# EAGLE design MaTouch Devkit_LED Screen V1.2 (EAGLE 6.1)
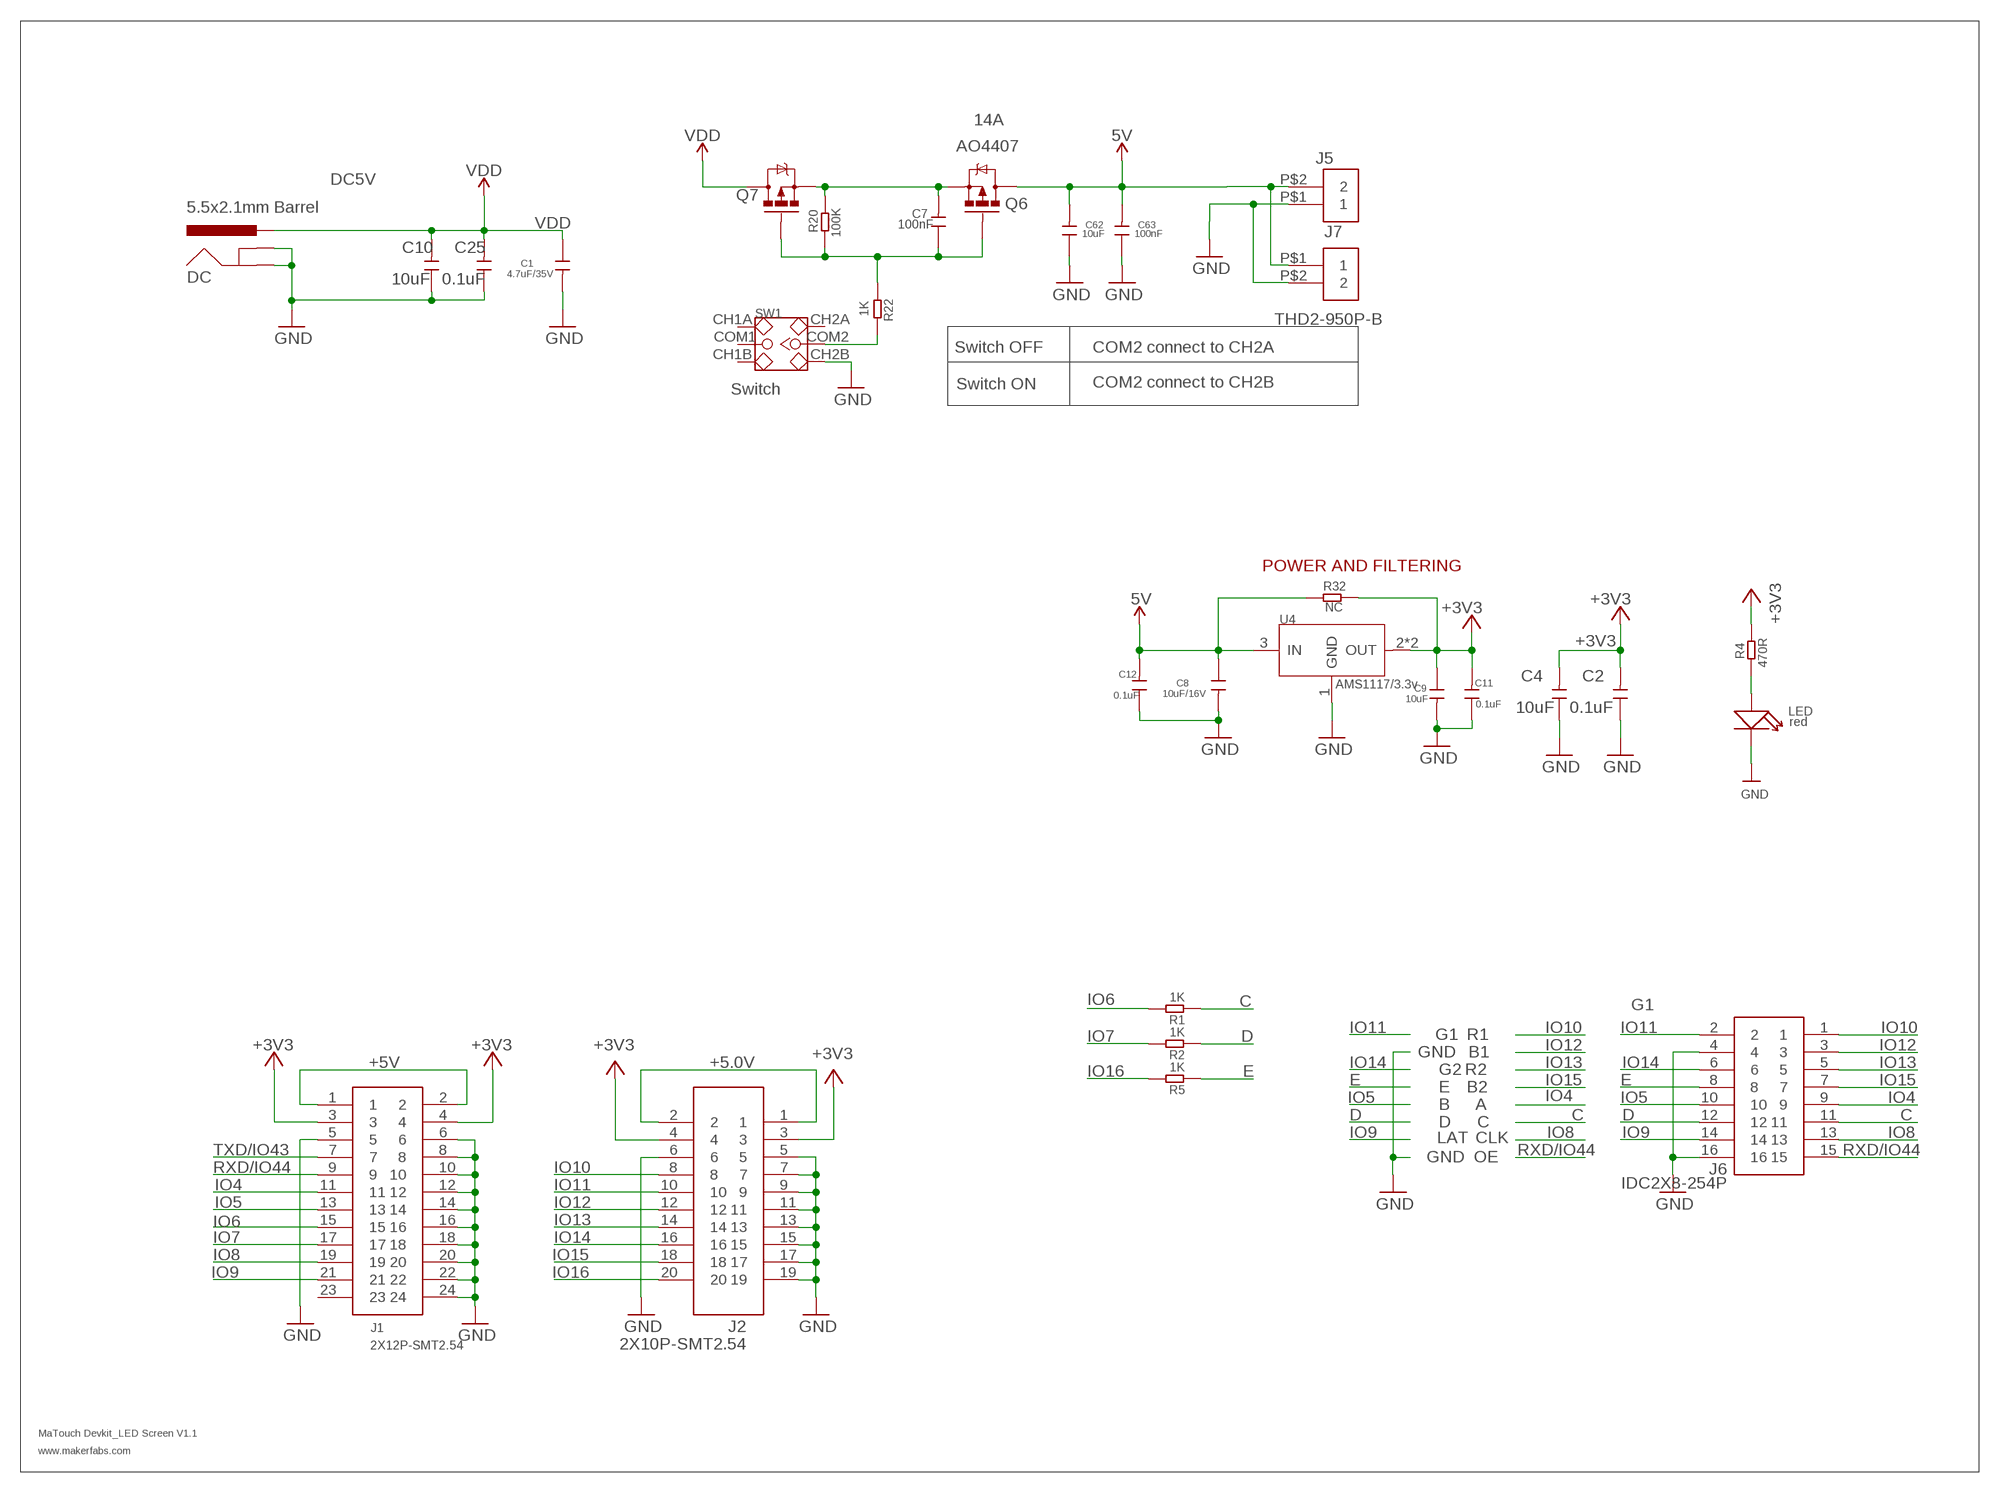
[diagram p0: schematic, sheet 1]

## Parts
C1  4.7uF/35V  C-0603  [0603]
C2  0.1uF  C-0603  [0603]
C4  10uF  C-0603  [0603]
C7  100nF  C-0603  [0603]
C8  10uF/16V  C-0603  [0603]
C9  10uF  C-0603  [0603]
C10  10uF  C-0603  [0603]
C11  0.1uF  C-0603  [0603]
C12  0.1uF  C-0603  [0603]
C25  0.1uF  C-0603  [0603]
C62  10uF  C-0603  [0603]
C63  100nF  C-0603  [0603]
DC  5.5x2.1mm Barrel  POWER_JACKSMD  [POWER_JACK_SMD]
J1  2X12P-SMT2.54  [2X12P-SMT2.54]
J2  2X10P-SMT2.54  [2X10P-SMT2.54]
J5  THD2-950P-2050L1620W1670H  [THD2-950P-2050L1620W1670H]
J6  IDC2X8-254P  IDC2X8-254P-2792L1330W890H  [IDC2X8-254P-2792L1330W890H]
J7  THD2-950P-B  [THD2-950P-2100L1580W1780H]
LED  red  DISCRETE_LED0603  [DISCRETE_LED-0603]
Q6  MOSFET-PCHANNELFDS6675  [SO08]
Q7  MOSFET-PCHANNELFDS6675  [SO08]
R1  1K  R-0603  [R0603]
R2  1K  R-0603  [R0603]
R4  470R  R-0603  [R0603]
R5  1K  R-0603  [R0603]
R20  100K  R-0603  [R0603]
R22  1K  R-0603  [R0603]
R32  NC  R-0603  [R0603]
SW1  SWITCH-2CH-6P'90D'  [6P-2CH-2.54-9.0X3.6-90D]
U4  AMS1117/3.3v  LD1117'SOT89'  [SOT89]

## Nets
5V: C8.1 C12.2 C62.2 C63.2 J5.P$2 J7.P$1 Q6.5(D) Q6.6(D) Q6.7(D) Q6.8(D) R32.1 U4.3(IN)
+3V3: C2.2 C4.2 C9.1 C11.2 J1.3 J1.4 J2.3 J2.4 R4.2 R32.2 U4.2(OUT) U4.4(OUT)
+5.0V: J2.1 J2.2
+5V: J1.1 J1.2
C: J6.11 R1.1
D: J6.12 R2.1
E: J6.8 R5.1
GND: C1.2 C2.1 C4.1 C8.2 C9.2 C10.1 C11.1 C12.1 C25.1 C62.1 C63.1 DC.GND(GNDBREAK) DC.P$4(GND) J1.5 J1.6 J1.8 J1.10 J1.12 J1.14 J1.16 J1.18 J1.20 J1.22 J1.24 J2.5 J2.6 J2.7 J2.9 J2.11 J2.13 J2.15 J2.17 J2.19 J5.P$1 J6.4 J6.16 J7.P$2 LED.- SW1.CH2B U4.1(GND)
IO4: J1.11 J6.9
IO5: J1.13 J6.10
IO6: J1.15 R1.2
IO7: J1.17 R2.2
IO8: J1.19 J6.13
IO9: J1.21 J6.14
IO10: J2.8 J6.1
IO11: J2.10 J6.2
IO12: J2.12 J6.3
IO13: J2.14 J6.5
IO14: J2.16 J6.6
IO15: J2.18 J6.7
IO16: J2.20 R5.2
N$2: LED.+ R4.1
N$9: C7.1 Q6.4(G) Q7.4(G) R20.2 R22.2
N$10: R22.1 SW1.COM2
N$49: C7.2 Q6.1(S) Q6.2(S) Q6.3(S) Q7.1(S) Q7.2(S) Q7.3(S) R20.1
RXD/IO44: J1.9 J6.15
TXD/IO43: J1.7
VDD: C1.1 C10.2 C25.2 DC.VIN0(PWR) Q7.5(D) Q7.6(D) Q7.7(D) Q7.8(D)
Unconnected: J1.23 SW1.CH1A SW1.CH1B SW1.CH2A SW1.COM1

## Notes on the sheet
- 14A
- AO4407
- DC5V
- Switch OFF | COM2 connect to CH2A
- Switch ON | COM2 connect to CH2B
- Switch
- POWER AND FILTERING
- G1
- G1 | R1
- GND | B1
- G2 | R2
- E | B2
- B | A
- D | C
- LAT | CLK
- GND | OE
- MaTouch Devkit_LED Screen V1.1
- www.makerfabs.com

## Library data of the parts
C1 C2 C4 C7-C12 C25 C62 C63 = Discrete:C*: Ceramic Capacitors
DC = SparkFun-Connectors:POWER_JACK: Power Jack Connector This is the standard 5.5mm barrel jack for power. The PTH is the most common, proven, reliable, footprint. The Slot footprint only works if the mill layer is transmitted to the PCB fab house so be warned. Here are the connectors we sell at SparkFun: DC Barrel Power Jack/Connector <https://www.sparkfun.com/products/119> (PRT-00119) DC Barrel Power Jack/Connector (SMD) <https://www.sparkfun.com/products/12748> (PRT-12748) DC Barrel Jack Adapter - Breadboard Compatible <https://www.sparkfun.com/products/10811> (PRT-10811) It is used on this SparkFun product (and many, many others): SparkFun RedBoard - Programmed with Arduino <https://www.sparkfun.com/products/12757> (DEV-12757) Also, if you need a mating power supply or connector, please check these out: Wall Adapter Power Supply - 9VDC 650mA <https://www.sparkfun.com/products/298> (TOL-00298) DC Barrel Jack Adapter - Male <https://www.sparkfun.com/products/10287> (PRT-10287); PROD_ID: CONN-08106; SF_ID: PRT-12748
J1 = sale:2X12P-SMT2.54
J2 = sale:2X10P-SMT2.54
J5 = user:THD2-950P-2050L1620W1670H
J6 = user:IDC2X8-254P-2792L1330W890H
J7 = user:THD2-950P-B
LED = A9G:DISCRETE_LED*
Q6 Q7 = User-Submitted:MOSFET-PCHANNEL: Generic PMOSFET IRLML2244 - TRANS-11153 (SOT-23 -20V -4.3A) (1.Gate 2.Source 3.Drain) FQP27P06 - COM-10349 <http://www.sparkfun.com/products/10349> (TO-220 -60V -27A) (1.Gate 2.Source 3.Drain)
R1 R2 R4 R5 R20 R22 R32 = Discrete:R*
SW1 = Discrete:SWITCH-2CH-6P
U4 = IC:LD1117: Low Drop Fixed And Adjustable Positive Voltage Regulators http://www.datasheetcatalog.org/datasheet/SGSThomsonMicroelectronics/mXuqtqv.pdf

## Net classes
0 default: width 0.203 mm, drill 0.305 mm, clearance 0.152 mm

## Board
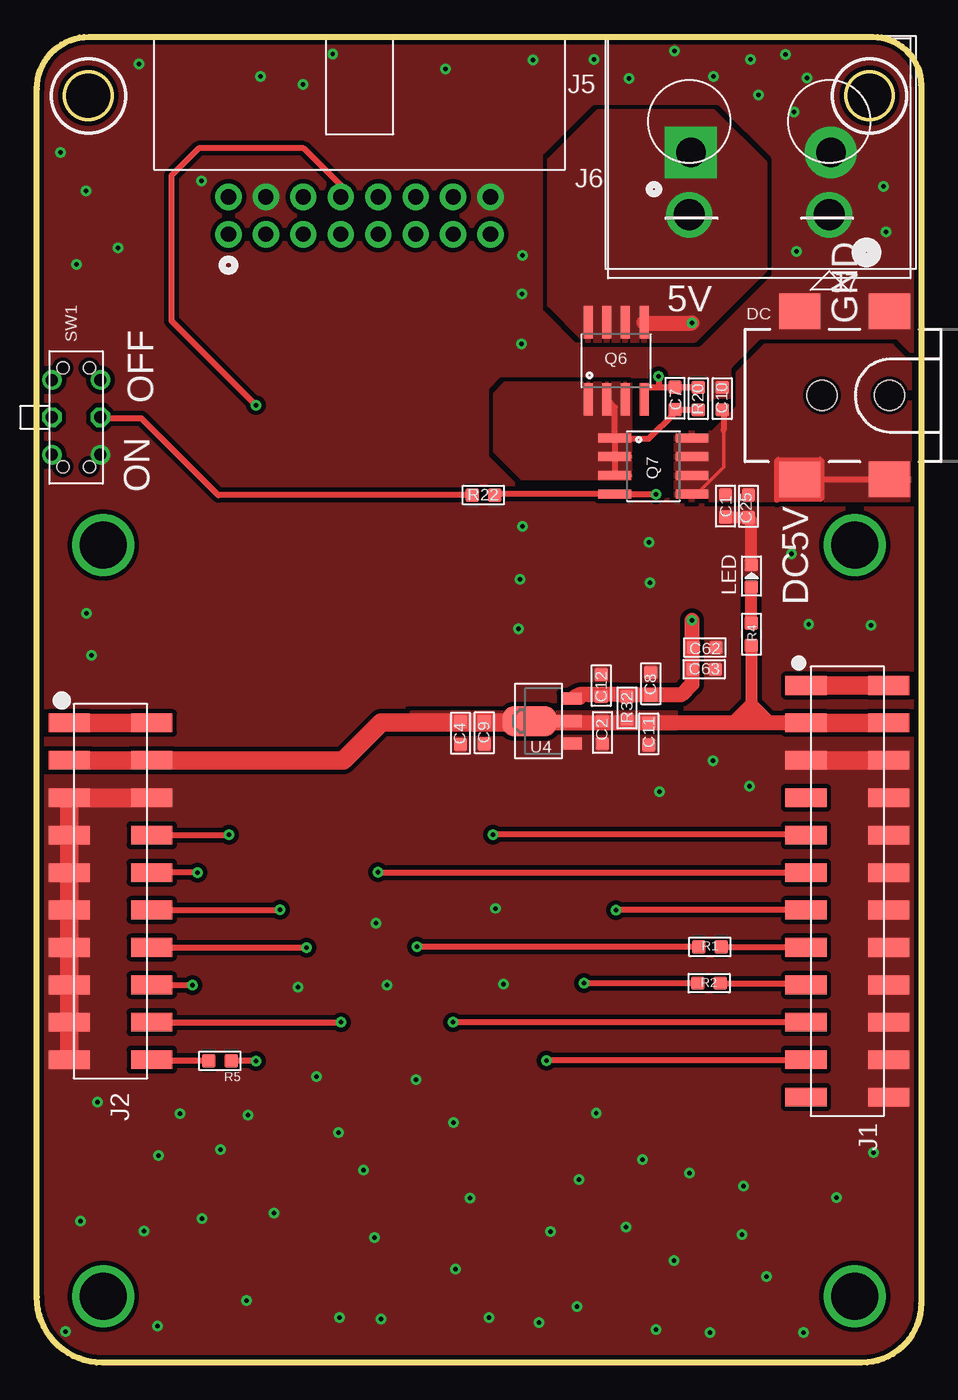
[diagram p1: board, top side]
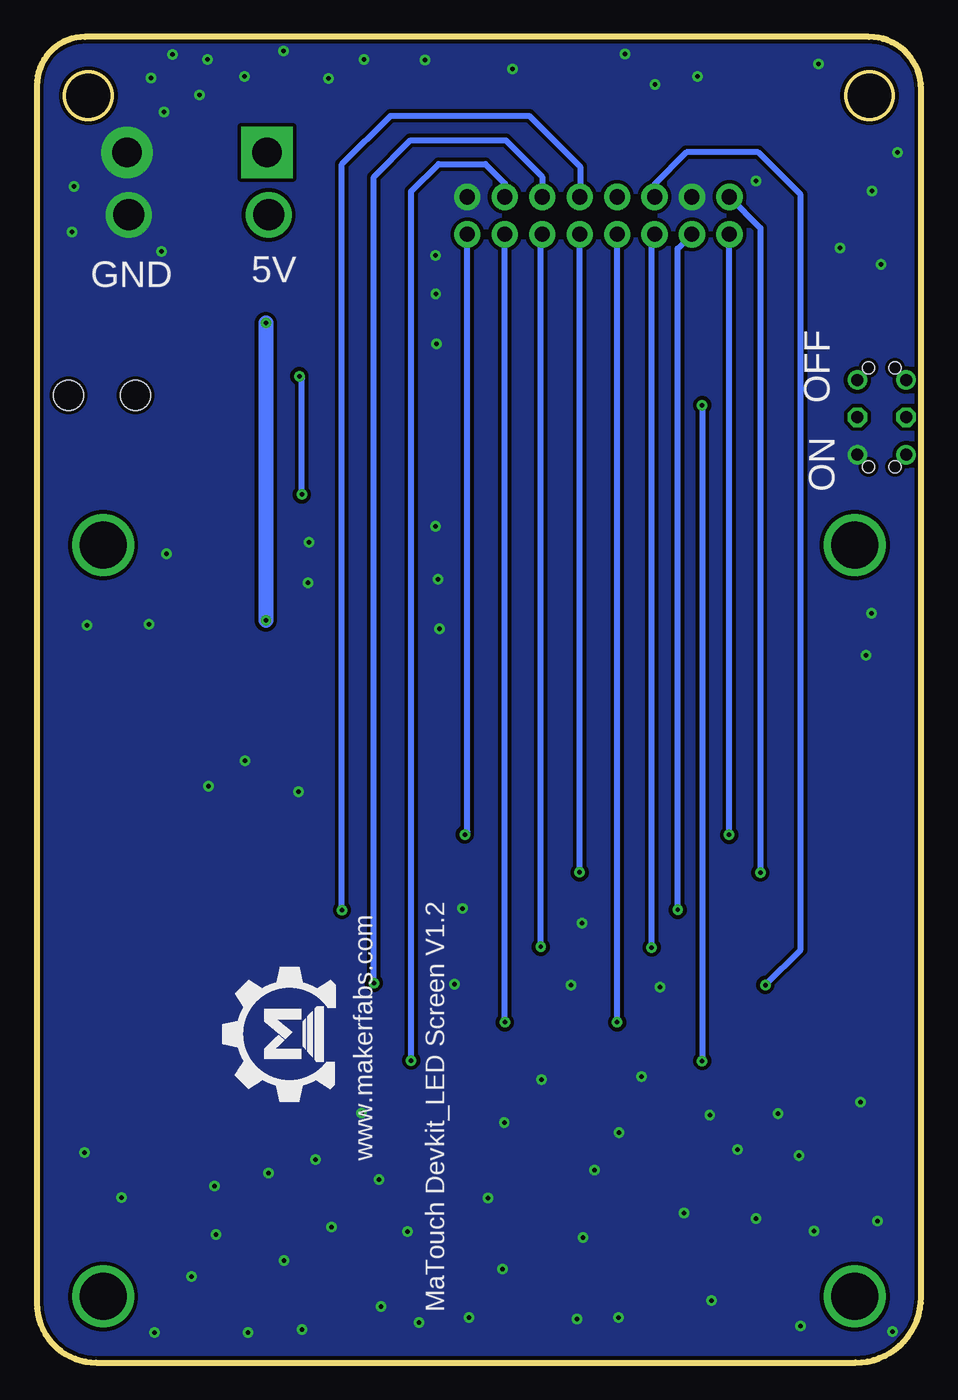
[diagram p2: board, bottom side, seen from below]

Size 60 x 90 mm. Coordinates in mm from the lower left corner, seen from the top.
Outline: 0,4.44 0,86.46 arc-90 3.54,90 56.73,90 arc-90 60,86.73 60,4.03 arc-90 55.97,0 4.44,0 arc-90 0,4.44
Outline: circle at 3.5,86 radius 1.6
Outline: circle at 56.5,86 radius 1.6
Copper layers (1*16): Top 0.035mm / dielectric 1.5mm / Bottom 0.035mm
Design rules: minimum track width 10mil, minimum drill 10mil, track to track 8mil, track to pad 8mil, pad to pad 8mil, via to via 8mil, smd to smd 0mil, copper to edge 10mil, drill to drill 8mil, minimum pad ring 10mil, minimum via ring 8mil, stop-mask expansion 4mil, vias tented up to drill 30mil, thermal gap 0mil

### Footprints (pad centres in the part's own frame; a part is rotated, then mirrored left to right if it is on the bottom)
0603 = smd 0.889 x 0.889: 1 -0.762,0; 2 0.762,0
POWER_JACK_SMD = smd 2.8 x 2.4: GND 0,-5.7; P$4 6.1,-5.7; VIN0 0,5.7; VIN1 6.1,5.7 | hole 2.032: 0,0; 4.572,0
2X12P-SMT2.54 = smd 1.27 x 2.8: 1 -13.97,-2.8; 2 -13.97,2.8; 3 -11.43,-2.8; 4 -11.43,2.8; 5 -8.89,-2.8; 6 -8.89,2.8; 7 -6.35,-2.8; 8 -6.35,2.8; 9 -3.81,-2.8; 10 -3.81,2.8; 11 -1.27,-2.8; 12 -1.27,2.8; 13 1.27,-2.8; 14 1.27,2.8; 15 3.81,-2.8; 16 3.81,2.8; 17 6.35,-2.8; 18 6.35,2.8; 19 8.89,-2.8; 20 8.89,2.8; 21 11.43,-2.8; 22 11.43,2.8; 23 13.97,-2.8; 24 13.97,2.8
2X10P-SMT2.54 = smd 1.27 x 2.8: 1 -11.43,-2.8; 2 -11.43,2.8; 3 -8.89,-2.8; 4 -8.89,2.8; 5 -6.35,-2.8; 6 -6.35,2.8; 7 -3.81,-2.8; 8 -3.81,2.8; 9 -1.27,-2.8; 10 -1.27,2.8; 11 1.27,-2.8; 12 1.27,2.8; 13 3.81,-2.8; 14 3.81,2.8; 15 6.35,-2.8; 16 6.35,2.8; 17 8.89,-2.8; 18 8.89,2.8; 19 11.43,-2.8; 20 11.43,2.8
THD2-950P-2050L1620W1670H = drill 2.1: P$1 0,0; P$2 9.5,0
IDC2X8-254P-2792L1330W890H = drill 1.02 pad 1.778: 1 0,0; 2 0,2.54; 3 2.54,0; 4 2.54,2.54; 5 5.08,0; 6 5.08,2.54; 7 7.62,0; 8 7.62,2.54; 9 10.16,0; 10 10.16,2.54; 11 12.7,0; 12 12.7,2.54; 13 15.24,0; 14 15.24,2.54; 15 17.78,0; 16 17.78,2.54
THD2-950P-2100L1580W1780H = drill 2 pad 3.5 square: P$1 0,0 | drill 2 pad 3.5: P$2 9.5,0
DISCRETE_LED-0603 = smd 0.889 x 0.889: + -0.762,0; - 0.762,0
SO08 = smd 0.61 x 2.21: 1 -1.905,-2.616; 2 -0.635,-2.616; 3 0.635,-2.616; 4 1.905,-2.616; 5 1.905,2.616; 6 0.635,2.616; 7 -0.635,2.616; 8 -1.905,2.616
R0603 = smd 0.889 x 0.889: 1 -0.762,0; 2 0.762,0
6P-2CH-2.54-9.0X3.6-90D = drill 0.813 pad 1.27: CH1A -2.54,-1.65; CH1B 2.54,-1.65; CH2A -2.54,1.65; CH2B 2.54,1.65 | drill 0.813 pad 1.27 octagon: COM1 0,-1.65; COM2 0,1.65 | hole 0.813: -3.35,0.9; -3.35,-0.9; 3.35,0.9; 3.35,-0.9
SOT89 = smd 0.8 x 1.4: 1 -1.524,-1.905; 3 1.524,-1.905 | smd 0.8 x 1.9: 2 0,-1.651 | smd 2.032 x 3.65: 4 0,0.94

### Placement (x,y rotation side)
C1  46.74,58.15 270 top
C2  38.38,42.78 90 top
C4  28.75,42.72 90 top
C7  43.31,65.47 270 top
C8  41.66,46.09 90 top
C9  30.36,42.76 270 top
C10  46.51,65.44 270 top
C11  41.53,42.68 90 top
C12  38.3,45.96 270 top
C25  48.29,58.13 90 top
C62  45.32,48.54 180 top
C63  45.28,47.07 180 top
DC  57.86,65.65 180 top
J1  55,32 270 top
J2  5,32 270 top
J5  53.77,77.91 180 top
J6  13,76.59 0 top
J7  44.37,82.16 0 top
LED  48.49,53.4 90 top
Q6  39.31,68.01 0 top
Q7  41.83,60.86 270 top
R1  45.67,28.22 0 top
R2  45.62,25.76 0 top
R4  48.49,49.44 270 top
R5  12.42,20.48 180 top
R20  44.88,65.44 90 top
R22  30.3,58.89 0 top
R32  40.05,44.44 270 top
SW1  2.67,64.17 270 top
U4  34.36,43.55 90 top
U$2  [MAKERFABS_0.3]  39.79,18.18 90 bottom

### Tracks (layer width: path | path; a pad name or v marks a point on that pad's centre or on a via)
5V  (via drill 0.3)
  Top 0.406: U4.3 36.07,45.27 | R32.1 C12.2 38.15,45.35 37.47,45.35 | 44.45,46.06 44.45,46.54 | 44.45,46.54 44.45,48.43 C62.2 | C63.2 44.52,46.61 44.45,46.54
  Top 0.813: 36.8,45.35 36.54,45.35 U4.3 36.29,45.08 36.3,45.07 36.88,45.07 36.91,45.1
  Top 1.016: C8.1 39.55,45.34 | 39.55,45.34 37.47,45.35 36.8,45.35 | Q6.5 41.26,70.57 v44.45,70.57 | v44.45,50.38 44.45,46.54 44.45,46.06 43.71,45.33 39.56,45.33 39.55,45.34
  Bottom 1.016: v44.45,70.57 v44.45,50.38
  pour Top: 37.19,69.45 44.65,69.45 49.38,74.18 49.38,81.42 45.9,84.9 38.1,84.9 34.8,81.6 34.8,71.84
+3V3
  Top 0.406: 28.73,43.5 C4.2 30.33,43.48 C9.1 | U4.4 U4.2 38.36,43.55 C2.2 39.91,43.54 R32.2 40.28,43.44 | J2.4 2.4,40.89 2.39,40.91
  Top 0.813: R4.2 48.49,43.51 48.41,43.43 47.34,43.43 47.24,43.52 48.46,44.74 49.68,43.52 49.71,43.52
  Top 1.016: J1.3 48.41,43.43 33.6,43.43 28.73,43.43 28.73,43.45
  Top 1.27: J1.4 J1.3 | J2.3 J2.4 20.79,40.89 23.37,43.47 33.58,43.47 33.6,43.5 33.48,43.5 U4.4 33.48,43.55 33.6,43.43
  pour Top: 43.38,44.16 25.4,44.16 25.4,43.01 43.38,43.01
+5.0V
  Top 1.27: J2.2 J2.1
+5V
  Top 1.27: J1.2 J1.1
C  (via drill 0.3)
  Top 0.406: R1.1 v25.81,28.22 v25.81,28.23
  Bottom 0.406: v25.81,28.23 25.81,76.59 J6.11
D  (via drill 0.3)
  Top 0.406: R2.1 v37.14,25.76 v37.13,25.77
  Bottom 0.406: v37.13,25.77 37.13,80.48 34.65,82.97 28.17,82.97 25.7,80.5 J6.12
E  (via drill 0.3)
  Top 0.406: J6.8 20.62,79.92 18.11,82.43 10.97,82.43 9.14,80.61 9.14,80.58 9.14,70.72 v14.86,65 | v14.86,20.48 13.21,20.48 R5.1
  Bottom 0.406: v14.86,65 v14.86,20.48
GND  (via drill 0.3)
  Top 0.813: LED.- 48.49,57.16 C25.1 48.26,57.39 C1.2 48.21,57.39 48.28,57.31
  Top 1.27: J2.6 J2.5 J2.15 | J2.15 J2.17 | J2.17 2.2,21.73 | 2.2,21.73 J2.19 2.27,20.57 2.29,20.59 | J2.17 2.2,21.73 | J2.17 J2.15 | J1.5 J1.6
  other vias: 51.21,54.91 8.19,2.49 7.27,8.94 52.38,50.14 2.97,9.6 16.08,10.16 4.11,17.7 12.46,14.45 1.94,2.1 22.15,13.08 14.21,4.22 36.64,3.81 30.67,3.07 45.68,2.06 42,2.23 28.41,6.35 56.78,14.25 43.24,6.93 49.52,5.84 52.03,2.06 48.96,86.05 22.92,8.51 36.79,12.42 8.27,14.07 32.68,49.81 11.19,80.21 56.6,50.06 5.5,75.67 28.28,16.31 17.73,25.49 41.59,52.93 39.99,9.19 34.86,8.89 47.84,8.71 54.27,11.2 25.74,19.23 37.96,16.94 23.76,25.63 41.54,55.68 51.55,75.44 48.35,39.11 31.66,25.7 9.72,16.92 32.96,75.16 23,29.82 31.13,30.83 6.95,88.16 20.08,88.82 1.61,82.14 37.81,88.47 43.27,89.05 15.18,87.32 33.67,88.42 3.72,48 50.79,88.8 48.42,88.47 32.78,53.16 20.48,15.62 45.88,40.87 14.34,16.81 44.28,12.88 18.05,86.77 29.4,11.17 3.34,79.55 23.34,2.97 20.52,3.07 11.2,9.78 47.95,11.99 51.38,84.91 34.06,2.72 42.24,38.76 41.1,13.79 32.96,56.77 3.37,50.87 27.72,87.83 18.96,19.4 32.93,72.54 2.7,74.55 32.88,69.16 40.2,87.17 45.91,87.32 57.47,79.83 57.62,76.76 52.26,87.22
  pour Bottom (isolate 0.254, rank 4): -1.2,-15.8 -1.2,108 80,108 80,-15.8
  pour Top (isolate 0.305, rank 4, no thermals): -0.6,-15.8 -0.6,110 80,110 80,-15.8
IO4  (via drill 0.3)
  Top 0.406: v23.16,33.28 52.22,33.28 arc-90 52.25,33.26 J1.11 arc-90 J1.11
  Bottom 0.406: v23.16,33.28 J6.9
IO5  (via drill 0.3)
  Top 0.406: J1.13 v39.29,30.72
  Bottom 0.406: v39.29,30.72 39.29,81.34 35.99,84.64 26.59,84.64 23.14,81.19 23.14,79.16 J6.10
IO6
  Top 0.406: R1.2 52.2,28.22 J1.15
IO7
  Top 0.406: R2.2 52.2,25.76 J1.17
IO8  (via drill 0.3)
  Top 0.406: J1.19 v28.25,23.11 v28.25,23.1
  Bottom 0.406: v28.25,23.1 J6.13 | J6.13 28.25,76.62 J6.13
IO9  (via drill 0.3)
  Top 0.406: J1.21 52.2,20.51 v34.59,20.51
  Bottom 0.406: v34.59,20.51 34.59,79.51 32.74,81.37 29.57,81.37 28.25,80.05 J6.14
IO10  (via drill 0.3)
  Top 0.406: J2.8 13.03,35.81 v13.03,35.83
  Bottom 0.254: J6.1 13.03,76.62
  Bottom 0.406: v13.03,35.83 13.03,76.62
IO11  (via drill 0.3)
  Top 0.406: v10.9,33.26 10.89,33.27 J2.10
  Bottom 0.406: J6.2 10.9,77.02 v10.9,33.26
IO12  (via drill 0.3)
  Top 0.406: J2.12 16.5,30.73 v16.51,30.74
  Bottom 0.406: v16.51,30.74 16.51,75.63 J6.3
IO13  (via drill 0.3)
  Top 0.406: J2.14 18.28,28.19 v18.29,28.18
  Bottom 0.406: v18.29,28.18 18.29,76.39 J6.5
IO14  (via drill 0.3)
  Top 0.406: J2.16 10.56,25.65 v10.57,25.64
  Bottom 0.406: v10.57,25.64 8.18,28.03 8.18,79.28 11.05,82.16 15.93,82.16 18.09,80 J6.6
IO15  (via drill 0.3)
  Top 0.406: J2.18 arc90 J2.18 v20.62,23.1
  Bottom 0.254: 20.62,76.57 J6.7
  Bottom 0.406: v20.62,23.1 20.62,76.57 arc-90 20.65,76.59
IO16
  Top 0.406: R5.2 7.89,20.48 J2.20
N$1  (via drill 3.2)
  other vias: 4.5,4.5
N$2
  Top 0.813: R4.1 LED.+
N$6  (via drill 3.2)
  other vias: 55.5,4.5
N$7  (via drill 3.2)
  other vias: 55.5,55.5
N$8  (via drill 3.2)
  other vias: 4.5,55.5
N$9  (via drill 0.3)
  Top 0.406: Q6.4 41.21,66.14 arc-90 41.3,66.23 42.37,66.23 | 42.37,66.23 C7.1 | C7.1 44.86,66.23 | 44.86,66.23 arc-90 R20.2 arc90 44.86,66.23 | 44.86,66.23 44.86,66.18 | C7.1 44.86,66.23 | v42.01,58.94 v42,58.95 Q7.4 31.13,58.95 R22.2 | v42.19,66.97 42.19,66.23 42.37,66.23
  Bottom 0.406: v42.01,58.94 42.01,66.79 v42.19,66.97
N$10
  Top 0.406: R22.1 12.32,58.89 7.11,64.1 4.32,64.1 4.27,64.15 4.29,64.15 SW1.COM2
N$49
  Top 0.406: Q7.1 Q7.2 Q7.3 | R20.1 arc90 44.86,64.7 C7.2 43.31,64.5 41.5,62.7 39.28,62.7 Q7.1 | Q7.1 39.22,64.85 Q6.2
  pour Top: 40.31,66.48 40.31,60.01 32.89,60.01 31.06,61.83 31.06,65.8 31.75,66.48
RXD/IO44  (via drill 0.3)
  Top 0.406: J1.9 52.16,35.85 v30.96,35.85
  Bottom 0.406: v30.96,35.85 30.79,36.03 J6.15
VDD
  Top 0.254: 46.61,63.33 46.61,60.79 44.78,58.97 44.48,58.97 44.46,58.95 Q7.5
  Top 0.406: 50.24,58.56 50.24,58.64 | 50.24,58.64 50.24,61.17 50.34,61.28 53.14,61.28 53.2,61.21 | 53.2,61.21 53.24,61.17 53.24,58.71 53.16,58.64 50.24,58.64 | DC.VIN0 53.24,59.95 53.24,61.2 53.2,61.2 53.2,61.21 | C10.2 46.61,64.68 46.61,63.33
  pour Top: 43.38,63.05 43.38,58.63 59.21,58.63 59.21,67.75 57.99,68.97 49.43,68.97 47.6,67.14 47.6,64.78 45.87,63.05

### Text on the board
tPlace: 5V | GND | OFF | ON | DC5V
bPlace: 5V | GND | OFF | ON | www.makerfabs.com | MaTouch Devkit_LED Screen V1.2